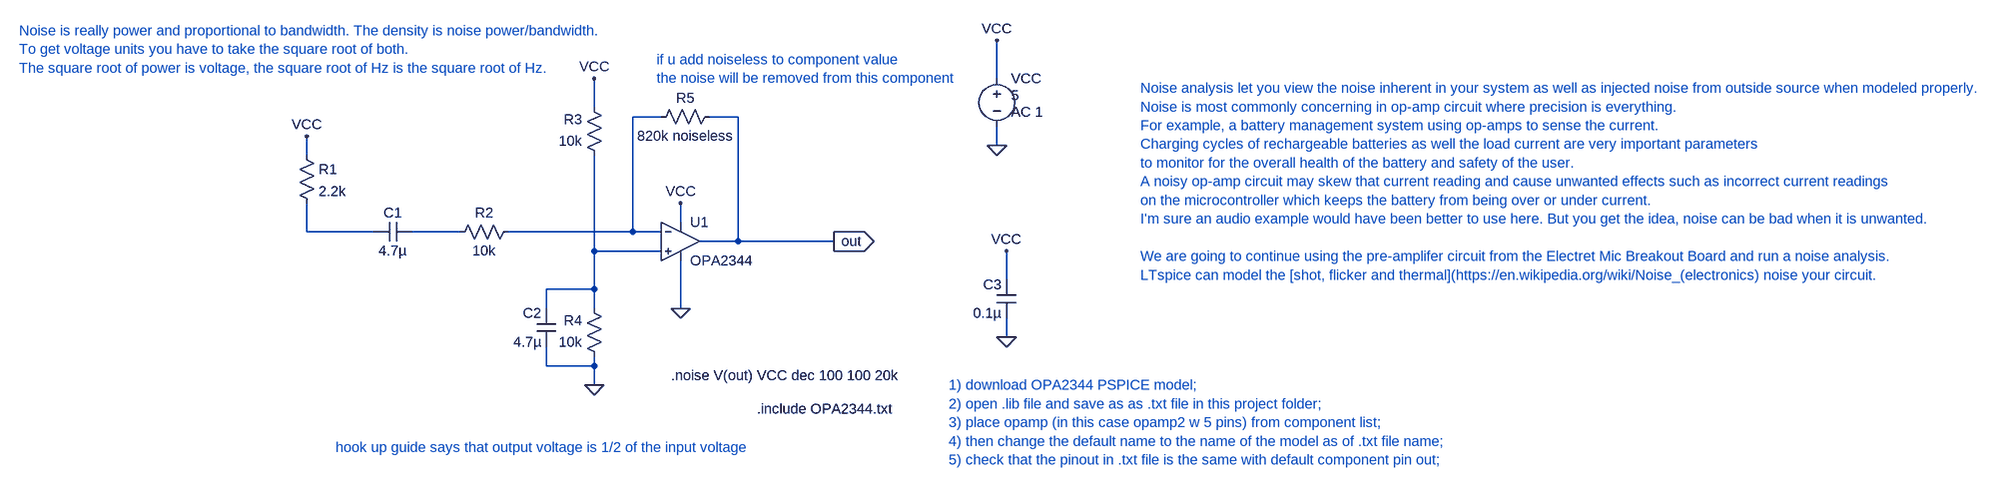
[diagram p0: schematic noise_analysis.asc]
noise_analysis.asc, the LTspice schematic file:
Version 4
SHEET 1 2788 680
WIRE 1024 -112 1024 -176
WIRE 352 -64 352 -112
WIRE 464 -48 416 -48
WIRE 592 -48 544 -48
WIRE 1024 0 1024 -32
WIRE -128 16 -128 -16
WIRE 496 128 496 96
WIRE -128 144 -128 96
WIRE -16 144 -128 144
WIRE 128 144 48 144
WIRE 416 144 416 -48
WIRE 416 144 208 144
WIRE 464 144 416 144
WIRE 592 160 592 -48
WIRE 592 160 528 160
WIRE 752 160 592 160
WIRE 352 176 352 16
WIRE 464 176 352 176
WIRE 1040 224 1040 176
WIRE 352 240 352 176
WIRE 352 240 272 240
WIRE 272 272 272 240
WIRE 352 272 352 240
WIRE 496 272 496 192
WIRE 1040 320 1040 288
WIRE 272 368 272 336
WIRE 352 368 352 352
WIRE 352 368 272 368
WIRE 352 400 352 368
FLAG 352 400 0
FLAG 496 272 0
FLAG 1040 320 0
FLAG 1024 0 0
FLAG 1024 -176 VCC
FLAG -128 -16 VCC
FLAG 352 -112 VCC
FLAG 752 160 out
IOPIN 752 160 Out
FLAG 1040 176 VCC
FLAG 496 96 VCC
SYMBOL res -144 0 R0
SYMATTR InstName R1
SYMATTR Value 2.2k
SYMBOL res 224 128 R90
WINDOW 0 0 56 VBottom 2
WINDOW 3 32 56 VTop 2
SYMATTR InstName R2
SYMATTR Value 10k
SYMBOL res 368 32 R180
WINDOW 0 36 76 Left 2
WINDOW 3 36 40 Left 2
SYMATTR InstName R3
SYMATTR Value 10k
SYMBOL res 368 368 R180
WINDOW 0 36 76 Left 2
WINDOW 3 36 40 Left 2
SYMATTR InstName R4
SYMATTR Value 10k
SYMBOL res 448 -32 R270
WINDOW 0 32 56 VTop 2
WINDOW 3 0 56 VBottom 2
SYMATTR InstName R5
SYMATTR Value 820k noiseless
SYMBOL cap 48 128 R90
WINDOW 0 0 32 VBottom 2
WINDOW 3 32 32 VTop 2
SYMATTR InstName C1
SYMATTR Value 4.7µ
SYMBOL cap 288 336 R180
WINDOW 0 24 56 Left 2
WINDOW 3 24 8 Left 2
SYMATTR InstName C2
SYMATTR Value 4.7µ
SYMBOL cap 1056 288 R180
WINDOW 0 24 56 Left 2
WINDOW 3 24 8 Left 2
SYMATTR InstName C3
SYMATTR Value 0.1µ
SYMBOL voltage 1024 -128 R0
WINDOW 3 24 44 Left 2
WINDOW 123 24 72 Left 2
WINDOW 39 0 0 Left 0
SYMATTR Value 5
SYMATTR Value2 AC 1
SYMATTR InstName VCC
SYMBOL OpAmps\\opamp2 496 96 R0
SYMATTR InstName U1
SYMATTR Value OPA2344
TEXT 1264 -96 Left 2 ;Noise analysis let you view the noise inherent in your system as well as injected noise from outside source when modeled properly.\nNoise is most commonly concerning in op-amp circuit where precision is everything.\nFor example, a battery management system using op-amps to sense the current.\nCharging cycles of rechargeable batteries as well the load current are very important parameters\nto monitor for the overall health of the battery and safety of the user.\nA noisy op-amp circuit may skew that current reading and cause unwanted effects such as incorrect current readings\non the microcontroller which keeps the battery from being over or under current.\nI'm sure an audio example would have been better to use here. But you get the idea, noise can be bad when it is unwanted.\n \nWe are going to continue using the pre-amplifer circuit from the Electret Mic Breakout Board and run a noise analysis.\nLTspice can model the [shot, flicker and thermal](https://en.wikipedia.org/wiki/Noise_(electronics) noise your circuit.
TEXT -80 504 Left 2 ;hook up guide says that output voltage is 1/2 of the input voltage
TEXT 944 400 Left 2 ;1) download OPA2344 PSPICE model;\n2) open .lib file and save as as .txt file in this project folder;\n3) place opamp (in this case opamp2 w 5 pins) from component list;\n4) then change the default name to the name of the model as of .txt file name;\n5) check that the pinout in .txt file is the same with default component pin out;
TEXT 624 440 Left 2 !.include OPA2344.txt
TEXT 480 384 Left 2 !.noise V(out) VCC dec 100 100 20k
TEXT -608 -192 Left 2 ;Noise is really power and proportional to bandwidth. The density is noise power/bandwidth.\nTo get voltage units you have to take the square root of both.\nThe square root of power is voltage, the square root of Hz is the square root of Hz.
TEXT 456 -144 Left 2 ;if u add noiseless to component value\nthe noise will be removed from this component

The netlist it stands for:
* noise_analysis.asc
R1 VCC N002 2.2k
R2 N001 N003 10k
R3 N004 VCC 10k
R4 0 N004 10k
R5 N001 out 820k noiseless
C1 N003 N002 4.7µ
C2 0 N004 4.7µ
C3 0 VCC 0.1µ
VCC VCC 0 5 AC 1
XU1 N004 N001 VCC 0 out OPA2344  ; pins In+ In- V+ V- OUT
* Noise analysis let you view the noise inherent in your system as well as injected noise from outside source when modeled properly.
* Noise is most commonly concerning in op-amp circuit where precision is everything.
* For example, a battery management system using op-amps to sense the current.
* Charging cycles of rechargeable batteries as well the load current are very important parameters
* to monitor for the overall health of the battery and safety of the user.
* A noisy op-amp circuit may skew that current reading and cause unwanted effects such as incorrect current readings
* on the microcontroller which keeps the battery from being over or under current.
* I'm sure an audio example would have been better to use here. But you get the idea, noise can be bad when it is unwanted.
* We are going to continue using the pre-amplifer circuit from the Electret Mic Breakout Board and run a noise analysis.
* LTspice can model the [shot, flicker and thermal](https://en.wikipedia.org/wiki/Noise_(electronics) noise your circuit.
* hook up guide says that output voltage is 1/2 of the input voltage
* 1) download OPA2344 PSPICE model;
* 2) open .lib file and save as as .txt file in this project folder;
* 3) place opamp (in this case opamp2 w 5 pins) from component list;
* 4) then change the default name to the name of the model as of .txt file name;
* 5) check that the pinout in .txt file is the same with default component pin out;
.include OPA2344.txt
.noise V(out) VCC dec 100 100 20k
* Noise is really power and proportional to bandwidth. The density is noise power/bandwidth.
* To get voltage units you have to take the square root of both.
* The square root of power is voltage, the square root of Hz is the square root of Hz.
* if u add noiseless to component value
* the noise will be removed from this component
.backanno
.end